# EAGLE schematic PPS_schematic (EAGLE 9.6.2)
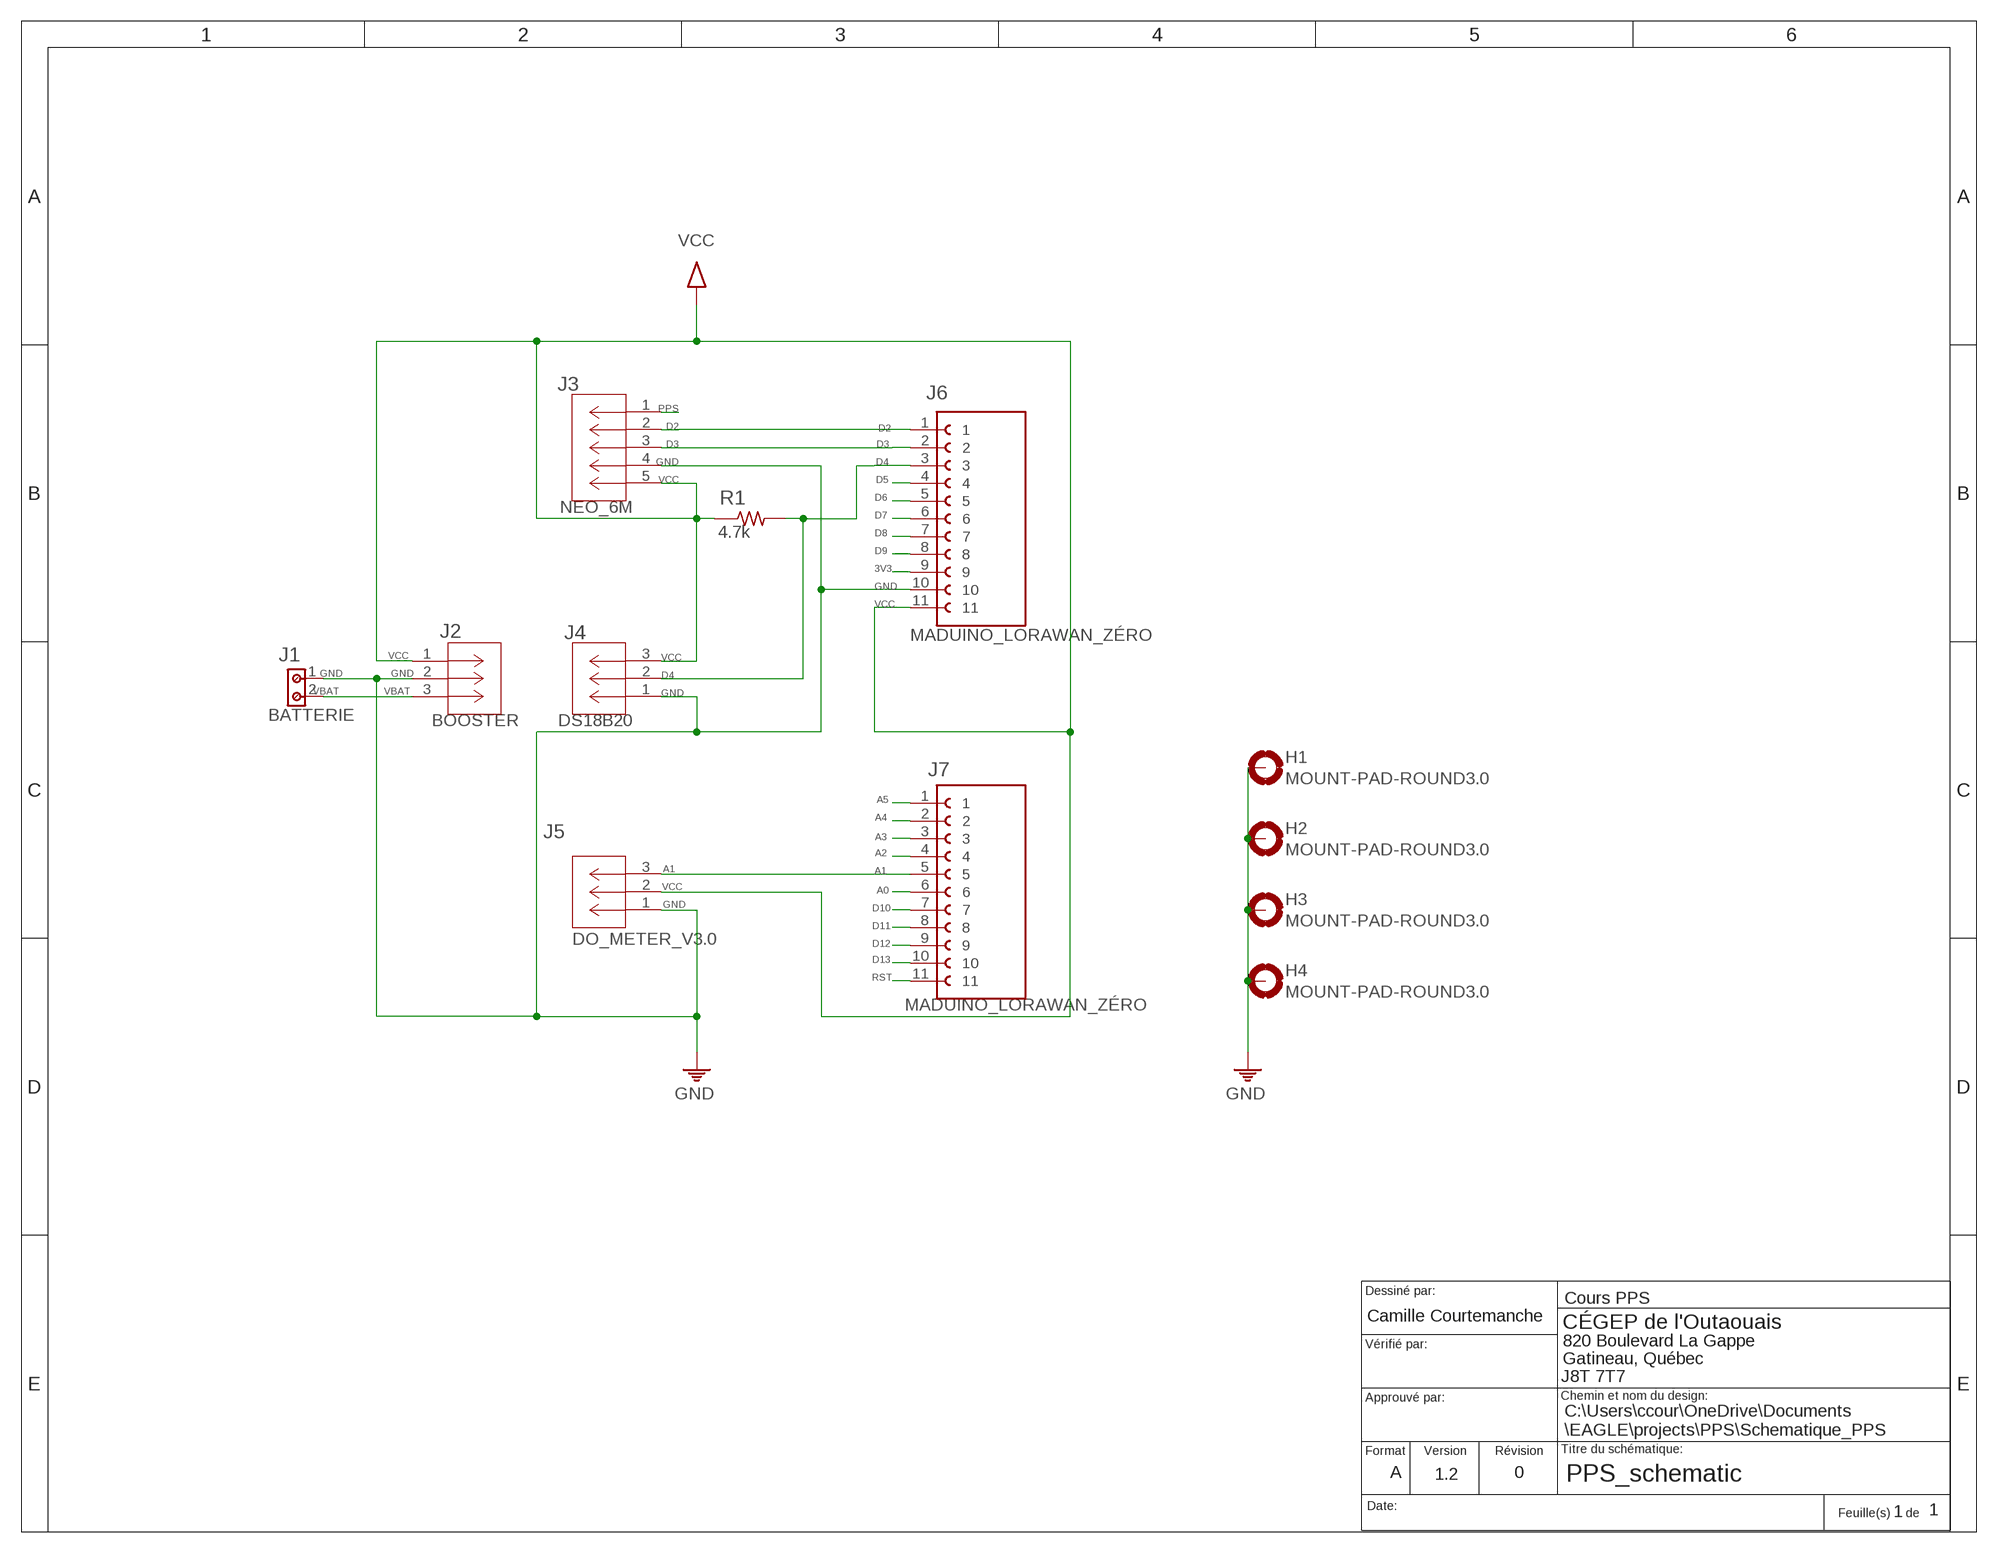
[diagram p0: schematic, sheet 1]

## Parts
H1  MOUNT-PAD-ROUND3.0  [3,0-PAD]
H2  MOUNT-PAD-ROUND3.0  [3,0-PAD]
H3  MOUNT-PAD-ROUND3.0  [3,0-PAD]
H4  MOUNT-PAD-ROUND3.0  [3,0-PAD]
J1  Batterie  691137710002  [691137710002]
J2  BOOSTER  TS-103-T-ACON3_1X3_TU_HTS_SAI  [CON3_1X3_TU_HTS_SAI]
J3  NEO-6M  PPTC051LFBN-RCCONN5_1LFBN-RC_SUL  [CONN5_1LFBN-RC_SUL]
J4  DS18B20  PPTC031LFBN-RCCONN_PPTC031_SUL  [CONN_PPTC031_SUL]
J5  D0_METTER_v3.0  PPTC031LFBN-RCCONN_PPTC031_SUL  [CONN_PPTC031_SUL]
J6  MADUINO_LORAWAN_ZÉRO  M20-7821146  [HARWIN_M20-7821146]
J7  MADUINO_LORAWAN_ZÉRO  M20-7821146  [HARWIN_M20-7821146]
R1  4.7k  RM1206  [M1206]

## Nets
3V3: J6.9
A0: J7.6
A1: J5.3 J7.5
A2: J7.4
A3: J7.3
A4: J7.2
A5: J7.1
D2: J3.2 J6.1
D3: J3.3 J6.2
D4: J4.2 J6.3 R1.2
D5: J6.4
D6: J6.5
D7: J6.6
D8: J6.7
D9: J6.8
D10: J7.7
D11: J7.8
D12: J7.9
D13: J7.10
GND: H1.B3,0(MOUNT) H2.B3,0(MOUNT) H3.B3,0(MOUNT) H4.B3,0(MOUNT) J1.1 J2.2 J3.4 J4.1 J5.1 J6.10
PPS: J3.1
RST: J7.11
VBAT: J1.2 J2.3
VCC: J2.1 J3.5 J4.3 J5.2 J6.11 R1.1

## Notes on the sheet
- NEO_6M
- MADUINO_LORAWAN_ZÉRO
- BATTERIE
- BOOSTER | DS18B20
- DO_METER_V3.0
- MADUINO_LORAWAN_ZÉRO
- Cours PPS
- Camille Courtemanche
- C:\Users\ccour\OneDrive\Documents
  \EAGLE\projects\PPS\Schematique_PPS
- A | 1.2 | 0
- 1 | 1

## Library data of the parts
H1-H4 = holes:MOUNT-PAD-ROUND: MOUNTING PAD, round
J1 = 691137710002:691137710002: WR-TBL Serie 1377 - 5.00 mm Horiz Entry w. Pressure Clamp Glow Wire KIND PROPERTIES Pitch 5 mm MATERIAL PROPERTIES Insulator Material PA6/66 Insulator Flammability Rating UL94 V-0 Insulator Color Green Contact Material Copper Alloy Contact Plating Tin over Nickel Terminal Screw Material Steel Terminal Screw Plating Zinc Wire Guard Material Copper Alloy with Tin GENERAL INFORMATION Operating Temperature -30 up to +120 °C Compliance Lead free / RoHS ELECTRICAL PROPERTIES IR UL 16 A IR VDE 24 A Working Voltage [UL] 300 V (AC) Working Voltage [VDE] 250 V (AC) Withstanding Voltage [UL] 1600 V (AC) Withstanding Voltage [VDE] 2000 V (AC) Contact Resistance 20 mΩ Contact Resistance [UL] 20 mΩ Contact Resistance [VDE] 20 mΩ MECHANICAL PROPERTIES Wire Strip Length 6 (mm) Screw M2.5 Solid Wire Section (AWG) 12 to 30 (AWG) Solid Wire Section (Metric) 3.31 to 0.05 (mm) Stranded Wire Section (AWG) 12 to 30 (AWG) Stranded Wire Section (Metric) 3.31 to 0.05 (mm) CERTIFICATION UL Approval E150931 VDE Approval 40021397 PACKAGING PROPERTIES Packaging Box <https://katalog.we-online.com/media/images/v2/o84014v209%20Family_WR-TBL1_6911377100xx.jpg> Details see: https://katalog.we-online.com/en/em/TBL_5_00_1377_HORIZONTAL_ENTRY_W_PRESSURE_CLAMP_GLOW_WIRE_6911377100xx Updated by Ella Wu 2019-11-08 2019(C) Wurth Elektronik; DATASHEET-URL: https://www.we-online.com/catalog/datasheet/691137710002.pdf; IR-UL: 16A; IR-VDE: 24A; MOUNT: THT; PART-NUMBER: 691137710002; PINS: 2; PITCH: 5mm; TYPE: Horizontal; VALUE: 691137710002; WIRE: 12 to 30 (AWG) 3.31 to 0.05 (mm²); WORKING-VOLTAGE-UL: 300V(AC); WORKING-VOLTAGE-VDE: 250V(AC)
J2 = 2024-10-23_16-09-23_Library:TS-103-T-A; COPYRIGHT: Copyright (C) 2024 Ultra Librarian. All rights reserved.; MANUFACTURER_PART_NUMBER: TS-103-T-A; MFR_NAME: Samtec Inc
J3 = 2024-10-31_13-50-36_Library:PPTC051LFBN-RC; COPYRIGHT: Copyright (C) 2024 Ultra Librarian. All rights reserved.; MANUFACTURER_PART_NUMBER: PPTC051LFBN-RC; MFR_NAME: Sullins
J4 J5 = 2024-10-23_16-02-51_Library:PPTC031LFBN-RC; COPYRIGHT: Copyright (C) 2024 Ultra Librarian. All rights reserved.; MANUFACTURER_PART_NUMBER: PPTC031LFBN-RC; MFR_NAME: Sullins
J6 J7 = M20-7821146:M20-7821146; MANUFACTURER: HARWIN; STANDARD: Manufacturer Recommendations
R1 = 1_TGE:R: R